# EAGLE design PCB_Cajero_08 (EAGLE 8.6.3)
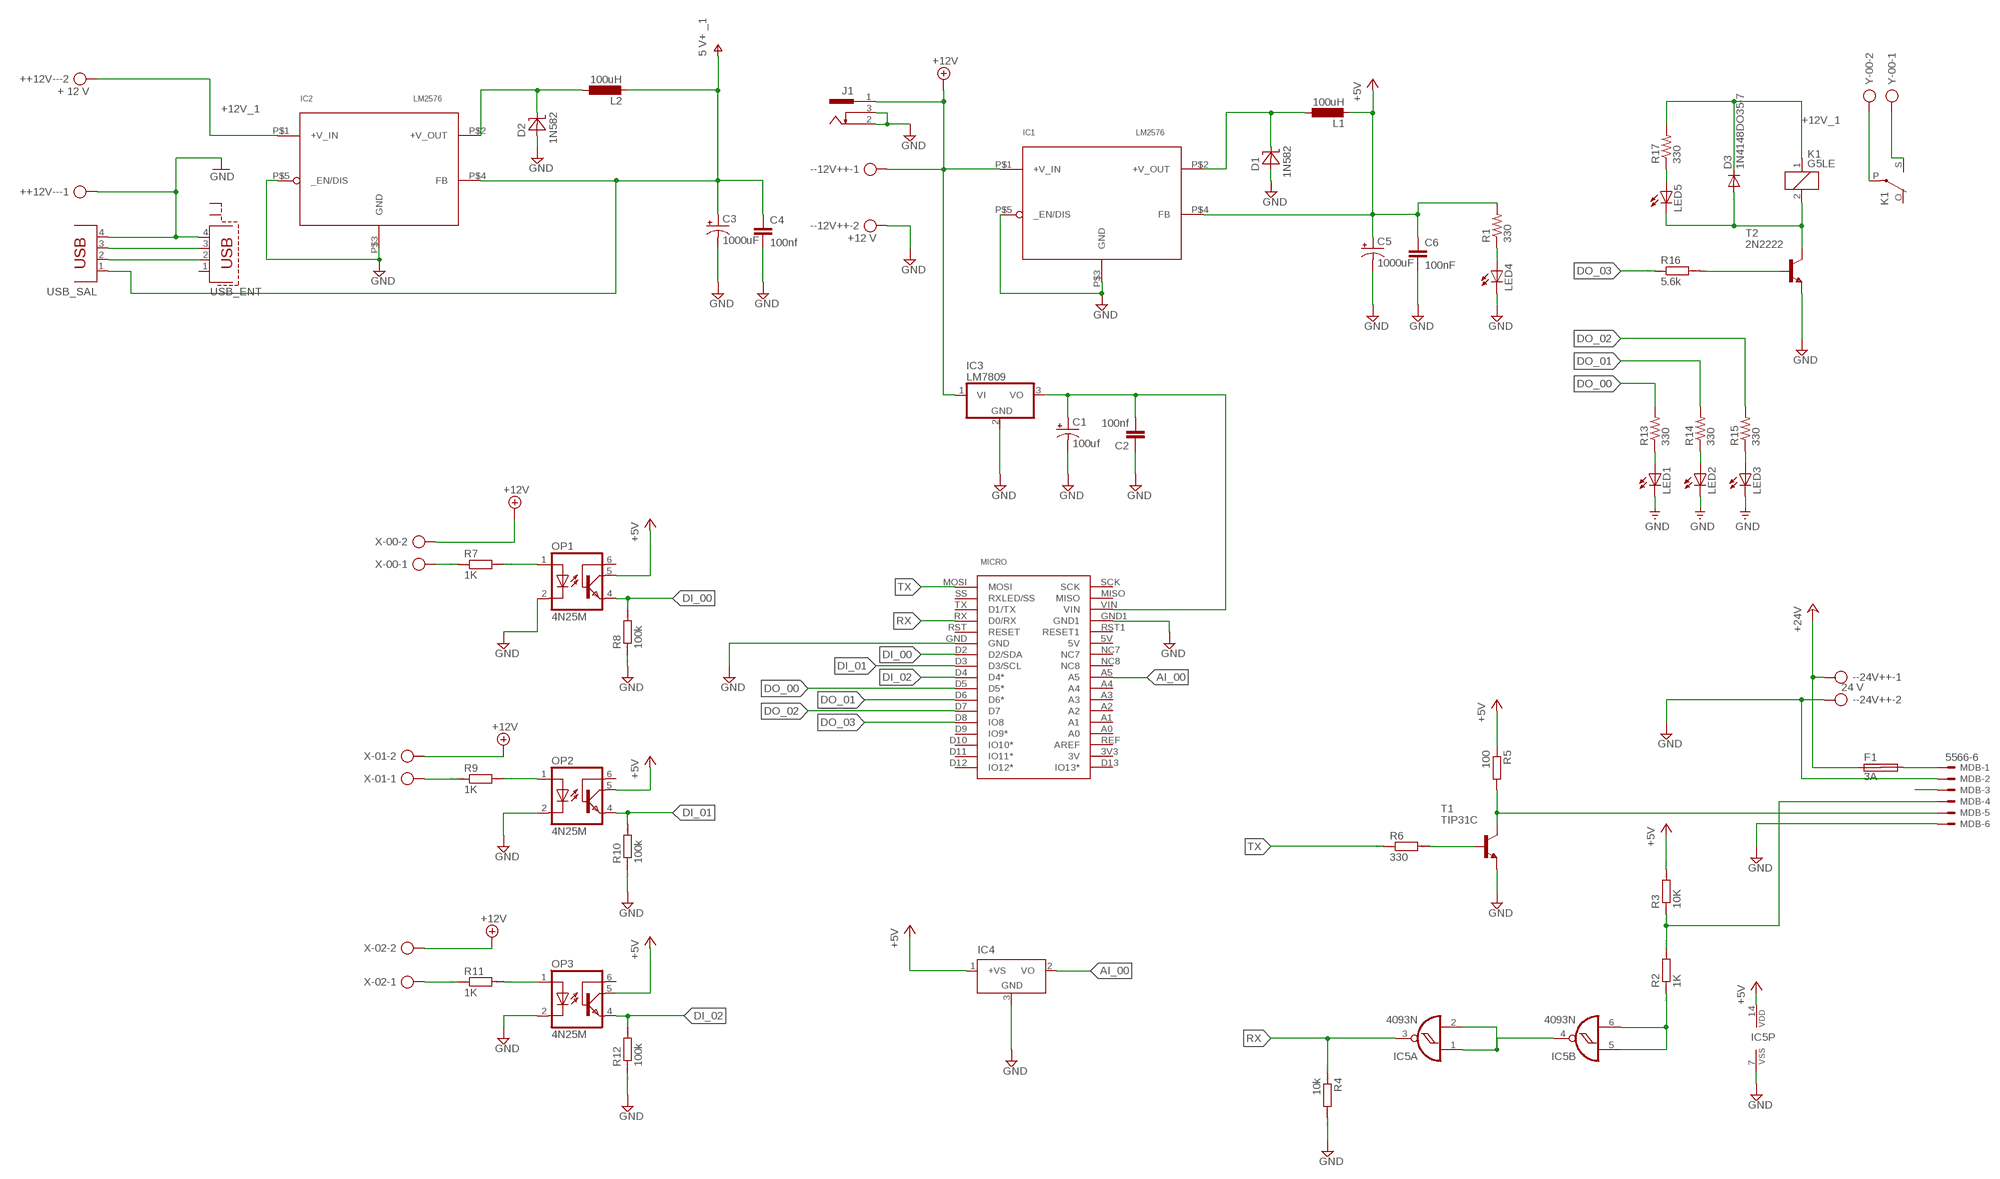
[diagram p0: schematic, sheet 1]

## Parts
++12V--  + 12 V  AK500/2  [AK500/2]
--12V++  +12 V  AK500/2  [AK500/2]
--24V++  24 V  AK500/2  [AK500/2]
C1  100uf  CPOL-USE2.5-6  [E2,5-6]
C2  100nf  C2,5-3  [C2.5-3]
C3  1000uF  CPOL-USE5-5  [E5-5]
C4  100nf  C2,5-3  [C2.5-3]
C5  1000uF  CPOL-USE5-5  [E5-5]
C6  100nF  C2,5-3  [C2.5-3]
D1  1N582  [1N582*]
D2  1N582  [1N582*]
D3  1N4148DO35-7  [DO35-7]
F1  3A  SHK20L  [SHK20L]
IC1  LM2576  LM2576-T05E  [TO220_SEP]
IC2  LM2576  LM2576-T05E  [TO220_SEP]
IC3  LM7809  [TO-220V]
IC4  LM35CZ  [TO92]
IC5  4093N  [DIL14]
J1  KLDVX-0202-A  [KLDVX-0202-A]
K1  G5LE  [G5LE]
L1  100uH  DO3316P  [DO3316P]
L2  100uH  DO3316P  [DO3316P]
LED1  LED5MM  [LED5MM]
LED2  LED5MM  [LED5MM]
LED3  LED5MM  [LED5MM]
LED4  LED5MM  [LED5MM]
LED5  LED5MM  [LED5MM]
MDB  5566-6  [5566-6]
MICRO  ARDUINO_MICROFOOTPRINT  [ARDUINO-MICRO]
OP1  4N25M  [DIL06]
OP2  4N25M  [DIL06]
OP3  4N25M  [DIL06]
R1  330  R-US_0207/7  [0207/7]
R2  1K  R0204/7  [0204/7]
R3  10K  R0204/7  [0204/7]
R4  10k  R0204/7  [0204/7]
R5  100  R-EU_0309/10  [0309/10]
R6  330  R0204/7  [0204/7]
R7  1K  R0204/7  [0204/7]
R8  100k  R0204/7  [0204/7]
R9  1K  R0204/7  [0204/7]
R10  100k  R0204/7  [0204/7]
R11  1K  R0204/7  [0204/7]
R12  100k  R0204/7  [0204/7]
R13  330  R-US_0207/7  [0207/7]
R14  330  R-US_0207/7  [0207/7]
R15  330  R-US_0207/7  [0207/7]
R16  5.6k  R0204/7  [0204/7]
R17  330  R-US_0207/7  [0207/7]
T1  TIP31C  [TO-220V]
T2  2N2222  [TO18]
USB_ENT  PN61729-S  [PN61729-S]
USB_SAL  PN87520  [PN87520]
X-00  AK500/2  [AK500/2]
X-01  AK500/2  [AK500/2]
X-02  AK500/2  [AK500/2]
Y-00  AK500/2  [AK500/2]

## Nets
+5V: C5.+ C6.1 IC1.P$4(FB) IC4.1(+VS) IC5.14(P:VDD) L1.1 OP1.5(COL) OP2.5(COL) OP3.5(COL) R1.2 R3.2 R5.1
+12V: --12V++.1 IC1.P$1(+V_IN) IC3.1(VI) J1.1 X-00.2 X-01.2 X-02.2
+12V_1: ++12V--.2 D3.C IC2.P$1(+V_IN) K1.1 R17.2
+24V: --24V++.1 F1.1A
AI_00: IC4.2(VO) MICRO.A5
DI_00: MICRO.D2(D2/SDA) OP1.4(EMI) R8.2
DI_01: MICRO.D3(D3/SCL) OP2.4(EMI) R10.2
DI_02: MICRO.D4(D4*) OP3.4(EMI) R12.2
DO_00: MICRO.D5(D5*) R13.2
DO_01: MICRO.D6(D6*) R14.2
DO_02: MICRO.D7 R15.2
DO_03: MICRO.D8(IO8) R16.1
GND: ++12V--.1 --12V++.2 --24V++.2 C1.- C2.1 C3.- C4.2 C5.- C6.2 D1.A D2.A IC1.P$3(GND) IC1.P$5(_EN/DIS) IC2.P$3(GND) IC2.P$5(_EN/DIS) IC3.2(GND) IC4.3(GND) IC5.7(P:VSS) J1.2 J1.3 LED1.K(C) LED2.K(C) LED3.K(C) LED4.K(C) MDB.2 MDB.6 MICRO.GND MICRO.GND1 OP1.2(C) OP2.2(C) OP3.2(C) R4.2 R8.1 R10.1 R12.1 T1.3(E) T2.1(E) USB_ENT.4 USB_SAL.4
N$1: C1.+ C2.2 IC3.3(VO) MICRO.VIN
N$2: R7.1 X-00.1
N$3: R11.1 X-02.1
N$4: USB_ENT.3 USB_SAL.3
N$5: USB_ENT.2 USB_SAL.2
N$6: F1.2A MDB.1
N$7: MDB.3
N$8: LED4.A R1.1
N$9: D1.C IC1.P$2(+V_OUT) L1.2
N$10: LED5.A R17.1
N$11: OP1.1(A) R7.2
N$13: LED1.A R13.1
N$14: LED2.A R14.1
N$15: LED3.A R15.1
N$18: OP2.1(A) R9.2
N$19: R9.1 X-01.1
N$22: OP3.1(A) R11.2
N$23: R16.2 T2.2(B)
N$25: IC5.1(A:I0) IC5.2(A:I1) IC5.4(B:O)
N$27: D3.A K1.2 LED5.K(C) T2.3(C)
N$28: K1.P(2:P) Y-00.2
N$29: K1.S(2:S) Y-00.1
N$34: MDB.5 R5.2 T1.2(C)
N$35: R6.2 T1.1(B)
N$36: IC5.5(B:I0) IC5.6(B:I1) R2.1
N$37: MDB.4 R2.2 R3.1
N$39: D2.C IC2.P$2(+V_OUT) L2.2
RX: IC5.3(A:O) MICRO.RX(D0/RX) R4.1
TX: MICRO.MOSI R6.1
V+: C3.+ C4.1 IC2.P$4(FB) L2.1 USB_SAL.1 ; supply symbol labelled 5 V+ _1
Unconnected: F1.1B F1.2B IC5.8(C:I0) IC5.9(C:I1) IC5.10(C:O) IC5.11(D:O) IC5.12(D:I0) IC5.13(D:I1) J1.1@1 J1.2@1 J1.3@1 K1.O(2:O) MICRO.3V3(3V) MICRO.5V MICRO.A0 MICRO.A1 MICRO.A2 MICRO.A3 MICRO.A4 MICRO.D9(IO9*) MICRO.D10(IO10*) MICRO.D11(IO11*) MICRO.D12(IO12*) MICRO.D13(IO13*) MICRO.MISO MICRO.NC7 MICRO.NC8 MICRO.REF(AREF) MICRO.RST1(RESET1) MICRO.RST(RESET) MICRO.SCK MICRO.SS(RXLED/SS) MICRO.TX(D1/TX) OP1.6(BAS) OP2.6(BAS) OP3.6(BAS) USB_ENT.1 USB_ENT.S1 USB_ENT.S2

## Library data of the parts
++12V-- --12V++ --24V++ X-00 X-01 X-02 Y-00 = con-ptr500:AK500/2: CONNECTOR; OC_FARNELL: unknown; OC_NEWARK: unknown
C1 = adafruit:CPOL-US: POLARIZED CAPACITOR, American symbol
C2 C4 C6 = capacitor-wima:C: CAPACITOR naming: grid - package width
C3 C5 = rcl:CPOL-US: POLARIZED CAPACITOR, American symbol; SPICEPREFIX: C
D1 D2 = MOD:1N582*
D3 = diode:1N4148: DIODE high speed (Philips)
F1 = fuse:SHK20L: FUSE HOLDER 5 x 20 mm, SH contact, SHH1 Schukat, E1073 Buerklin; OC_FARNELL: unknown; OC_NEWARK: unknown
IC1 IC2 = LM2576_MOD:LM2576-T05E
IC3 = MOD:LM7809
IC4 = lm35:LM35: Single-Supply Centigrade Temperature Sensor Vout = (10mV/°C x Temp °C) +5mmmV Source: http://www.national.com/ds/LM/LM35.pdf
IC5 = 40xx:4093: Quad 2-input NAND schmitt trigger; SPICEPREFIX: J
J1 = con-kycon:KLDVX-0202-: Power Jack, Vertical, PCB Mount, 2.0 mm, 2.5 mm, 3.0 mm Center Pin Source: KLDVX-0202x.pdf; OC_FARNELL: unknown; OC_NEWARK: unknown
K1 = relay:G5LE: RELAY 1 x switch, 10 A/120 V AC, 8 A/30 V DC, Omron; OC_FARNELL: unknown; OC_NEWARK: unknown
L1 L2 = MOD:DO3316P: COILCRAFT; OC_FARNELL: unknown; OC_NEWARK: unknown
LED1-LED5 = adafruit:LED: LED OSRAM: - CHIPLED LG R971, LG N971, LY N971, LG Q971, LY Q971, LO R971, LY R971 LH N974, LH R974 LS Q976, LO Q976, LY Q976 LO Q996 - Hyper CHIPLED LW Q18S LB Q993, LB Q99A, LB R99A - SideLED LS A670, LO A670, LY A670, LG A670, LP A670 LB A673, LV A673, LT A673, LW A673 LH A674 LY A675 LS A676, LA A676, LO A676, LY A676, LW A676 LS A679, LY A679, LG A679 - Hyper Micro SIDELED® LS Y876, LA Y876, LO Y876, LY Y876 LT Y87S - SmartLED LW L88C, LW L88S LB L89C, LB L89S, LG L890 LS L89K, LO L89K, LY L89K LS L896, LA L896, LO L896, LY L896 - TOPLED LS T670, LO T670, LY T670, LG T670, LP T670 LSG T670, LSP T670, LSY T670, LOP T670, LYG T670 LG T671, LOG T671, LSG T671 LB T673, LV T673, LT T673, LW T673 LH T674 LS T676, LA T676, LO T676, LY T676, LB T676, LH T676, LSB T676, LW T676 LB T67C, LV T67C, LT T67C, LS T67K, LO T67K, LY T67K, LW E67C LS E67B, LA E67B, LO E67B, LY E67B, LB E67C, LV E67C, LT E67C LW T67C LS T679, LY T679, LG T679 LS T770, LO T770, LY T770, LG T770, LP T770 LB T773, LV T773, LT T773, LW T773 LH T774 LS E675, LA E675, LY E675, LS T675 LS T776, LA T776, LO T776, LY T776, LB T776 LHGB T686 LT T68C, LB T68C - Hyper Mini TOPLED® LB M676 - Mini TOPLED Santana® LG M470 LS M47K, LO M47K, LY M47K Source: http://www.osram.convergy.de/
MDB = MOD:5566-6: Mini FIT connector 6 pol Source: http://www.molex.com; MF: MOLEX; MPN: 95566-61002; OC_FARNELL: unknown; OC_NEWARK: 22K8620
MICRO = arduino-micro:ARDUINO_MICRO
OP1-OP3 = optocoupler:4N*?M: General Purpose 6-Pin Phototransistor Optocouplers Source: http://www.fairchildsemi.com/ds/4N/4N35-M.pdf; MPN: 4N25-M; OC_FARNELL: 1021349; OC_NEWARK: 98K9084
R1 R13-R15 R17 = rcl:R-US_: RESISTOR, American symbol; SPICEPREFIX: R
R2-R4 R6-R12 R16 = eagle-ltspice:R: RESISTOR, European symbol; SPICEMODEL: NONE; SPICEPREFIX: R
R5 = rcl:R-EU_: RESISTOR, European symbol; SPICEPREFIX: R
T1 = MOD:TIP31C
T2 = transistor-neu-to92:2N2222: NPN TRANSISTOR
USB_ENT = con-berg:PN61729-S: BERG USB connector; OC_FARNELL: unknown; OC_NEWARK: unknown
USB_SAL = con-berg:PN87520: BERG USB connector; OC_FARNELL: unknown; OC_NEWARK: unknown

## Board
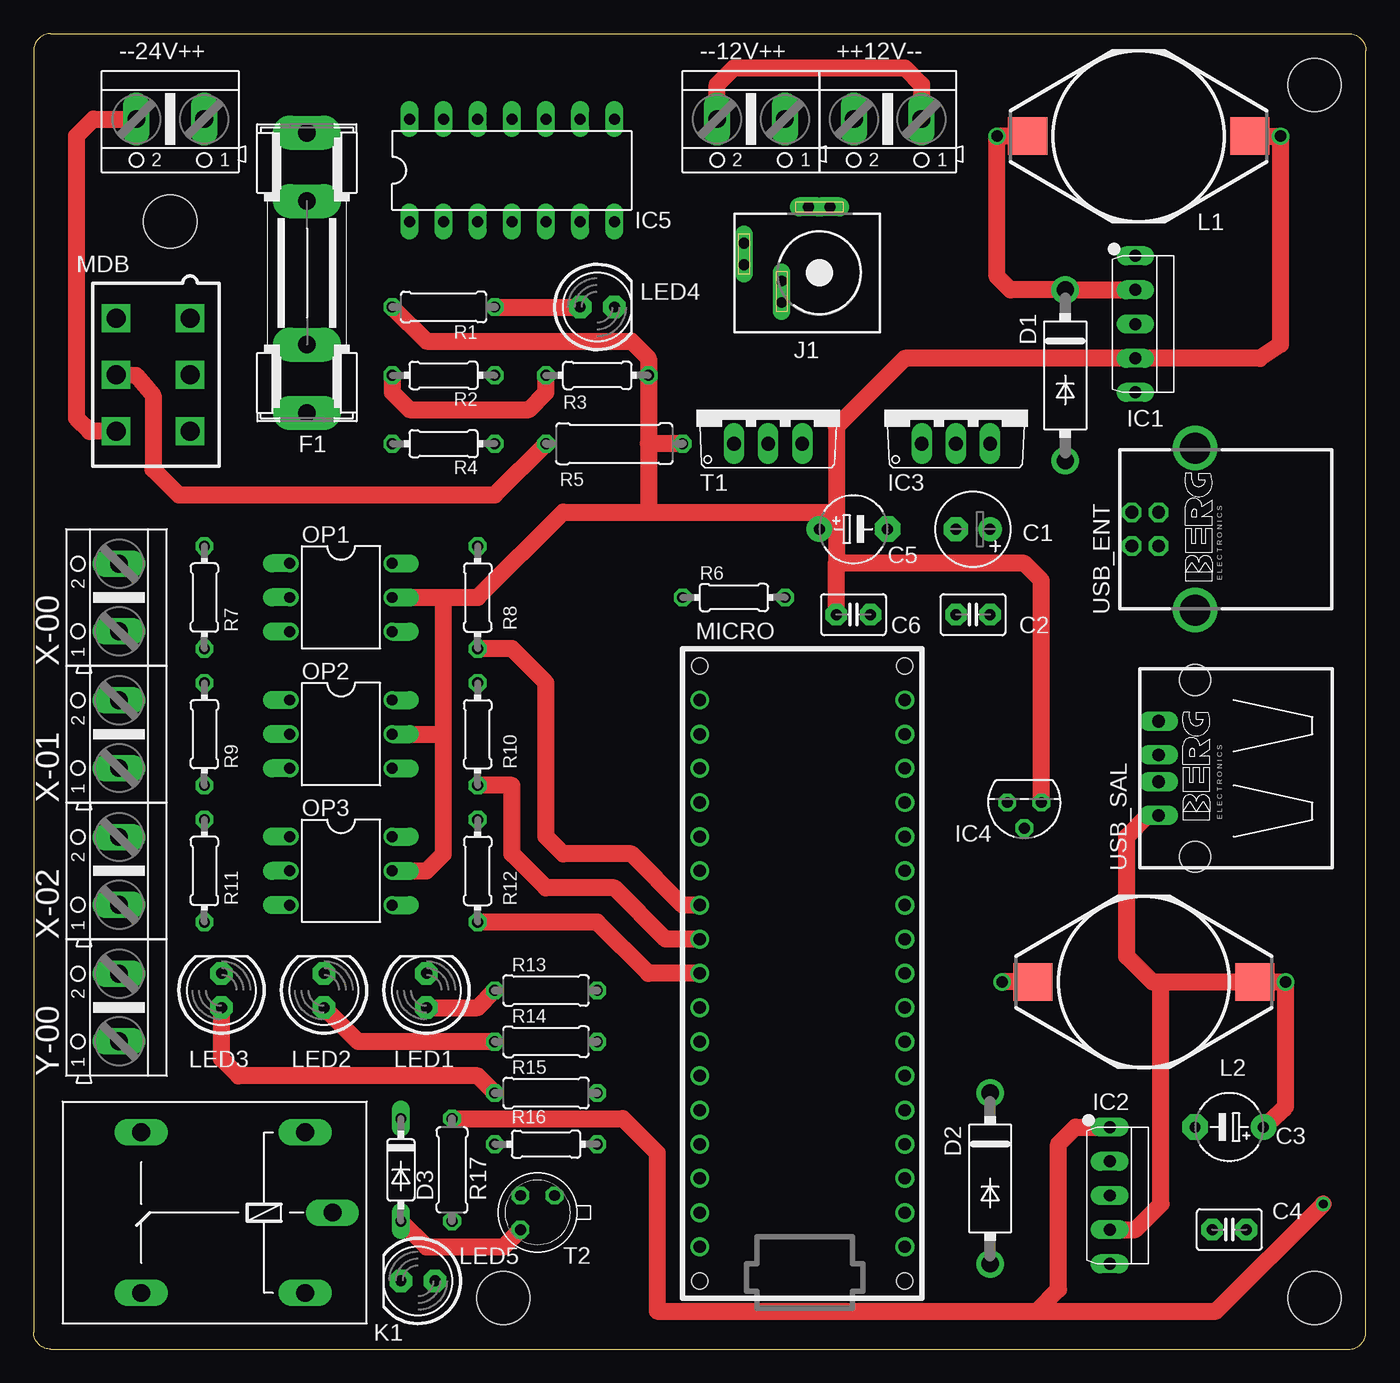
[diagram p1: board, top side]
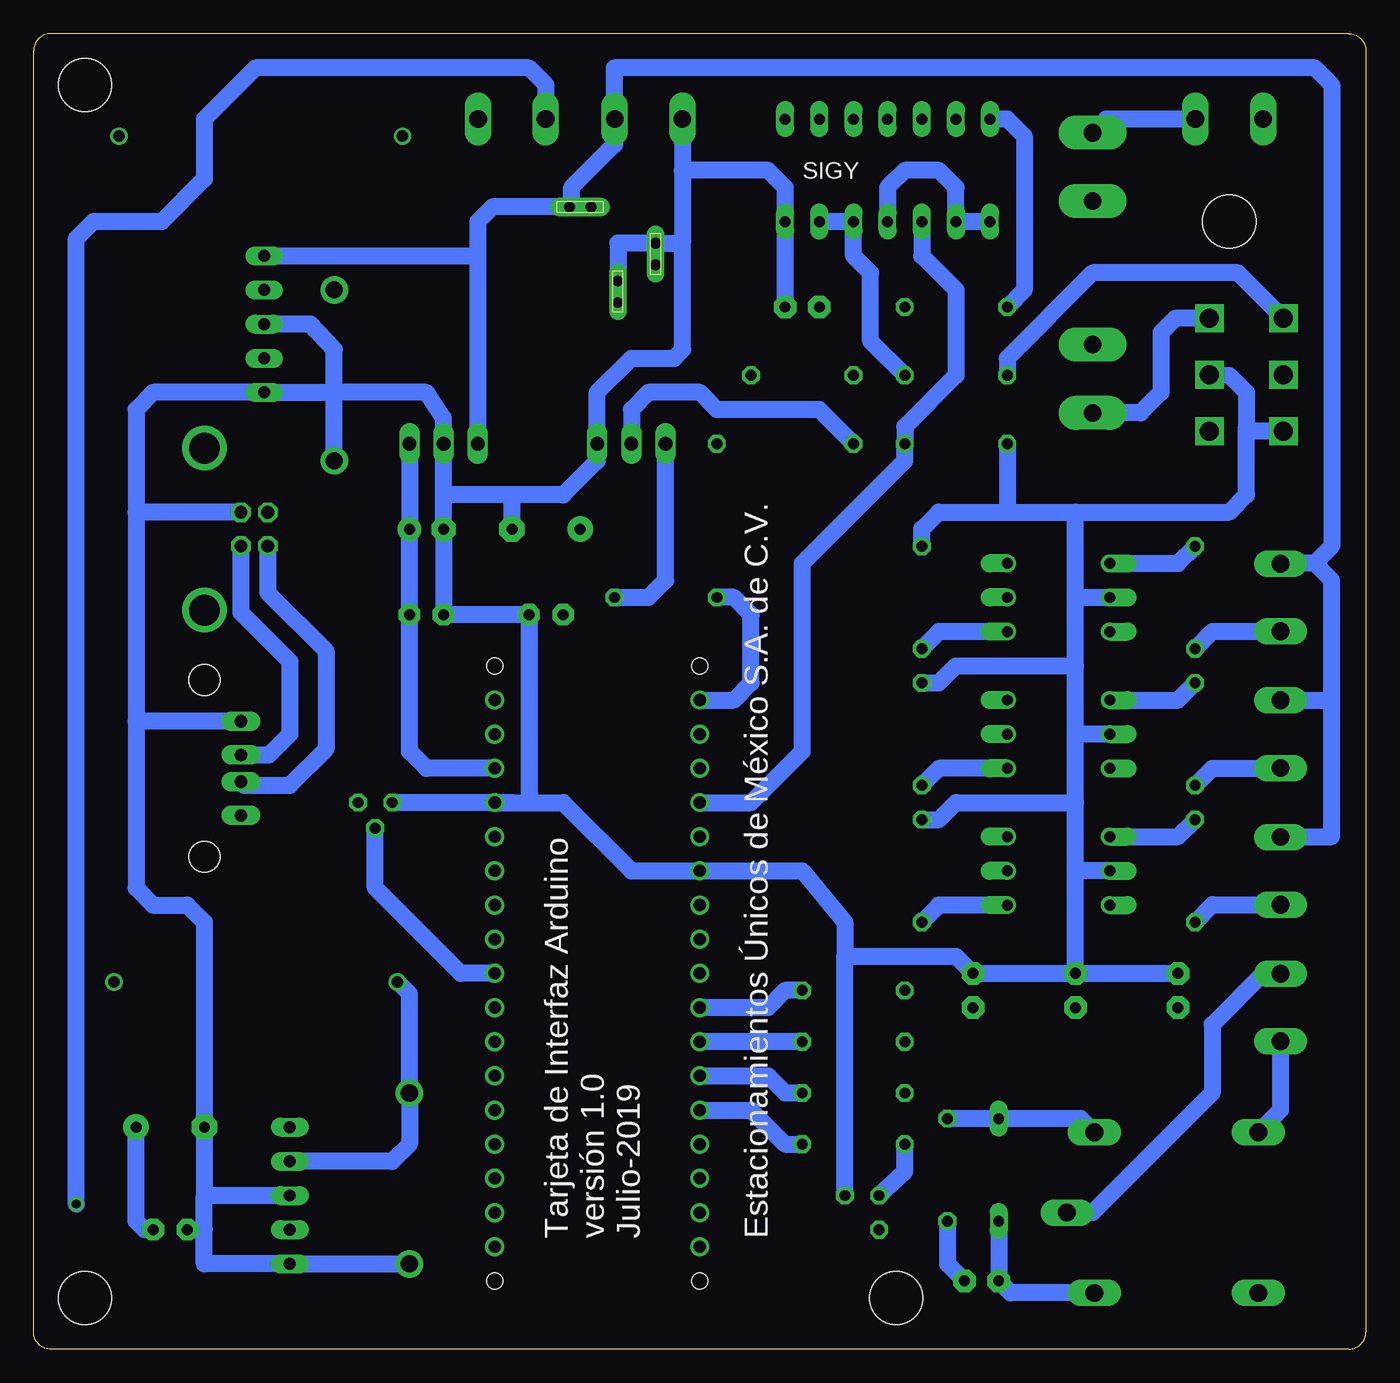
[diagram p2: board, bottom side, seen from below]

Size 99.06 x 97.79 mm. Coordinates in mm from the lower left corner, seen from the top.
Outline: 1.27,97.79 1.27,97.78
Outline: 1.27,97.79 arc90 0,96.52 0,1.27 arc90 1.27,0 97.79,0 arc90 99.06,1.27 99.06,96.52 arc90 97.79,97.79 1.27,97.79
Copper layers (1*16): Top 0.035mm / dielectric 1.5mm / Bottom 0.035mm
Design rules "default": minimum track width 6mil, minimum drill 0.35mm, track to track 6mil, track to pad 6mil, pad to pad 6mil, via to via 6mil, smd to smd 6mil, copper to edge 40mil, drill to drill 6mil, minimum pad ring 10mil, minimum via ring 8mil, stop-mask expansion 4mil, vias tented up to drill 0mil, thermal gap 10mil
Holes 3.97 mm at 10.16,83.82 95.25,93.98 95.25,3.81 34.92,3.81

### Footprints (pad centres in the part's own frame; a part is rotated, then mirrored left to right if it is on the bottom)
AK500/2 = drill 1.321 long: 1 -2.515,0; 2 2.515,0
E2,5-6 = drill 0.813 pad 1.778: + -1.27,0 | drill 0.813 pad 1.778 octagon: - 1.27,0
C2.5-3 = drill 0.813 pad 1.6 octagon: 1 -1.27,0; 2 1.27,0
E5-5 = drill 0.813 pad 1.905: + -2.54,0 | drill 0.813 pad 1.905 octagon: - 2.54,0
1N582* = drill 1.27 pad 2.032: A 5.715,0; C -6.985,0
DO35-7 = drill 0.813 long: A 3.81,0; C -3.81,0
SHK20L = drill 1.321 pad 2.54 long: 1A -10.414,0; 1B -5.334,0; 2A 10.414,0; 2B 5.334,0
TO220_SEP = drill 0.889 pad 1.219 long: P$1 -5.08,0; P$2 -2.54,0; P$3 0,0; P$4 2.54,0; P$5 5.08,0
TO-220V = drill 1.016 long: 1 -2.54,0; 2 0,0; 3 2.54,0
TO92 = drill 0.813 octagon: 1 -1.27,0; 2 0,1.905; 3 1.27,0
DIL14 = drill 0.813 long: 1 -7.62,-3.81; 2 -5.08,-3.81; 3 -2.54,-3.81; 4 0,-3.81; 5 2.54,-3.81; 6 5.08,-3.81; 7 7.62,-3.81; 8 7.62,3.81; 9 5.08,3.81; 10 2.54,3.81; 11 0,3.81; 12 -2.54,3.81; 13 -5.08,3.81; 14 -7.62,3.81
KLDVX-0202-A = drill 0.8 pad 1.4 long: 1 -4.9,0.8; 1@1 -4.9,-0.8 | drill 0.8 pad 1.3 long: 2 -2.2,-5.6; 2@1 -0.6,-5.6; 3 0.6,-2.8; 3@1 2.2,-2.8
G5LE = drill 1.321 long: 1 -7.493,-5.969; 2 -7.493,5.969; O 4.699,5.969; P -9.525,0; S 4.699,-5.969
DO3316P = smd 2.92 x 2.79: 1 -8.255,0; 2 8.255,0
LED5MM = drill 0.813 pad 1.676 octagon: A -1.27,0; K 1.27,0
5566-6 = drill 1.4 square: 1 4.2,-2.75; 2 0,-2.75; 3 -4.2,-2.75; 4 4.2,2.75; 5 0,2.75; 6 -4.2,2.75
ARDUINO-MICRO = drill 0.9: 3V3 16.51,3.81; 5V 16.51,29.21; A0 16.51,8.89; A1 16.51,11.43; A2 16.51,13.97; A3 16.51,16.51; A4 16.51,19.05; A5 16.51,21.59; D2 1.27,26.67; D3 1.27,24.13; D4 1.27,21.59; D5 1.27,19.05; D6 1.27,16.51; D7 1.27,13.97; D8 1.27,11.43; D9 1.27,8.89; D10 1.27,6.35; D11 1.27,3.81; D12 1.27,1.27; D13 16.51,1.27; GND 1.27,29.21; GND1 16.51,34.29; MISO 16.51,39.37; MOSI 1.27,41.91; NC7 16.51,26.67; NC8 16.51,24.13; REF 16.51,6.35; RST 1.27,31.75; RST1 16.51,31.75; RX 1.27,34.29; SCK 16.51,41.91; SS 1.27,39.37; TX 1.27,36.83; VIN 16.51,36.83 | hole 1.2: 1.27,-1.27; 16.51,-1.27; 1.27,44.45; 16.51,44.45
DIL06 = drill 0.813 offset: 1 -2.54,-3.81; 2 0,-3.81; 3 2.54,-3.81; 4 2.54,3.81; 5 0,3.81; 6 -2.54,3.81
0207/7 = drill 0.813 octagon: 1 -3.81,0; 2 3.81,0
0204/7 = drill 0.813 octagon: 1 -3.81,0; 2 3.81,0
0309/10 = drill 0.813 octagon: 1 -5.08,0; 2 5.08,0
TO18 = drill 0.813 octagon: 1 -1.27,-1.27; 2 1.27,-1.27; 3 1.27,1.27
PN61729-S = drill 0.95 octagon: 1 1.25,4.71; 2 -1.25,4.71; 3 -1.25,2.71; 4 1.25,2.71 | drill 2.3 pad 2.9: S1 -6.02,0; S2 6.02,0
PN87520 = drill 0.95 long: 1 -3.5,2.71; 2 -1,2.71; 3 1,2.71; 4 3.5,2.71 | hole 2.3: -6.57,0; 6.57,0

### Placement (x,y rotation side)
++12V--  63.5,91.44 180 top
--12V++  53.34,91.44 180 top
--24V++  10.16,91.44 180 top
C1  69.85,60.96 180 top
C2  69.85,54.61 0 top
C3  88.9,16.51 180 top
C4  88.9,8.89 180 top
C5  60.96,60.96 0 top
C6  60.96,54.61 0 top
D1  76.71,71.75 270 top
D2  71.12,12.06 270 top
D3  27.3,13.34 270 top
F1  20.32,80.01 270 top
IC1  81.92,76.2 270 top
IC2  80.01,11.43 270 top
IC3  68.58,67.31 0 top
IC4  73.66,40.64 180 top
IC5  35.56,87.63 0 top
J1  58.42,80.01 270 top
K1  12.7,10.16 180 top
L1  82.17,90.17 180 top
L2  82.55,27.3 180 top
LED1  29.21,26.67 90 top
LED2  21.59,26.67 90 top
LED3  13.97,26.67 90 top
LED4  41.91,77.47 0 top
LED5  28.57,5.08 180 top
MDB  8.88,72.43 90 top
MICRO  48.26,6.35 0 top
OP1  22.86,55.88 270 top
OP2  22.86,45.72 270 top
OP3  22.86,35.56 270 top
R1  30.48,77.47 180 top
R2  30.48,72.39 180 top
R3  41.91,72.39 0 top
R4  30.48,67.31 180 top
R5  43.18,67.31 180 top
R6  52.07,55.88 0 top
R7  12.7,55.88 90 top
R8  33.02,55.88 270 top
R9  12.7,45.72 90 top
R10  33.02,45.72 270 top
R11  12.7,35.56 90 top
R12  33.02,35.56 270 top
R13  38.1,26.67 0 top
R14  38.1,22.86 0 top
R15  38.1,19.05 0 top
R16  38.1,15.24 180 top
R17  31.11,13.34 90 top
T1  54.61,67.31 0 top
T2  37.47,10.16 180 top
USB_ENT  86.36,60.96 90 top
USB_SAL  86.36,43.18 90 top
X-00  6.35,55.88 90 top
X-01  6.35,45.72 90 top
X-02  6.35,35.56 90 top
Y-00  6.35,25.4 90 top

### Tracks (layer width: path | path; a pad name or v marks a point on that pad's centre or on a via)
+5V  (via drill 0.85)
  Top 1.27: 59.69,62.23 59.69,68.58 64.77,73.66 IC1.P$4 91.19,73.66 92.71,74.68 v92.71,90.17 L1.1 | OP3.5 29.21,35.56 30.48,36.83 30.48,45.72 | 30.48,45.72 30.48,55.88 | OP2.5 30.48,45.72 | OP1.5 30.48,55.88 | 30.48,55.88 33.02,55.88 39.37,62.23 45.72,62.23 | IC4.1 74.93,57.15 73.66,58.42 59.69,58.42 | 45.72,62.23 59.69,62.23 | R1.2 29.21,74.93 44.45,74.93 45.72,73.66 R3.2 45.72,67.31 | 45.72,67.31 45.72,62.23 | R5.1 45.72,67.31 | C6.1 59.69,58.42 | 59.69,62.23 59.69,60.96 | 59.69,60.96 59.69,58.42 | C5.+ 59.69,60.96
  Bottom 1.27: IC5.14 26.67,91.44 25.4,90.17 25.4,78.74 R1.2
+12V
  Top 1.27: X-00.2 6.33,58.42
  Bottom 1.27: X-02.2 6.33,38.1 2.54,38.1 2.54,48.26 | 2.54,48.26 2.54,57.15 3.81,58.42 | 3.81,58.42 6.35,58.42 X-00.2 | X-01.2 6.33,48.26 2.54,48.26 | 3.81,58.42 2.54,59.69 2.54,93.98 3.81,95.25 55.88,95.25 55.88,91.47 --12V++.1 55.85,89.56 59.05,86.36 59.05,85.08 J1.1 64.95,84.91 66.04,83.82 66.04,81.28 | 66.04,81.28 IC3.1 | IC1.P$1 66.04,81.28
+12V_1  (via drill 0.65)
  Top 1.27: 74.58,2.83 76.2,4.45 76.2,15.24 77.47,16.51 IC2.P$1 | 74.58,2.83 46.35,2.83 46.35,14.61 43.81,17.14 R17.2 | 74.58,2.83 87.92,2.83 v95.89,10.79
  Bottom 1.27: ++12V--.2 60.96,91.47 60.96,93.98 62.23,95.25 82.55,95.25 86.36,91.44 86.36,87 89.53,83.82 94.61,83.82 95.89,82.55 v95.89,10.79 | K1.1 21.21,17.14 D3.C R17.2
+24V
  Bottom 1.27: F1.1A 19.3,91.44 --24V++.1
AI_00
  Bottom 1.27: MICRO.A5 67.31,27.94 73.66,34.29 IC4.2
DI_00
  Top 1.27: MICRO.D2 48.26,33.02 44.45,36.83 39.37,36.83 38.1,38.1 38.1,49.53 35.56,52.07 R8.2
  Bottom 1.27: OP1.4 31.75,53.34 R8.2
DI_01
  Top 1.27: MICRO.D3 46.99,30.48 43.18,34.29 38.1,34.29 35.56,36.83 35.56,41.91 R10.2
  Bottom 1.27: OP2.4 31.75,43.18 R10.2
DI_02
  Top 1.27: MICRO.D4 45.72,27.94 41.91,31.75 R12.2
  Bottom 1.27: OP3.4 31.75,33.02 R12.2
DO_00
  Bottom 1.27: R13.2 43.18,26.67 44.45,25.4 MICRO.D5
DO_01
  Bottom 1.27: R14.2 MICRO.D6
DO_02
  Bottom 1.27: MICRO.D7 44.45,20.32 43.18,19.05 R15.2
DO_03
  Bottom 1.27: MICRO.D8 45.72,17.78 43.18,15.24 R16.1
GND
  Top 1.27: --12V++.2 50.83,94 52.07,95.25 64.77,95.25 66.02,94 ++12V--.1 | MDB.6 4.16,68.23 3.17,69.22 3.17,90.17 4.45,91.44 --24V++.2
  Bottom 1.27: 63.5,63.5 59.69,63.5 57.15,66.04 T1.3 57.15,71.12 54.61,73.66 51.44,73.66 50.8,74.3 50.83,74.32 50.83,82.21 | 63.5,63.5 68.58,63.5 | 68.58,63.5 IC3.2 68.58,69.22 69.85,71.12 76.71,71.12 | 68.58,63.5 C1.- C2.1 C6.2 62.23,40.64 | 50.83,87.63 50.83,82.21 | 63.5,40.64 MICRO.GND1 | D1.A 76.71,71.12 | 76.71,71.12 76.71,74.3 78.49,76.2 IC1.P$3 | MICRO.GND1 62.23,40.64 | 62.23,40.64 59.69,40.64 54.61,35.56 MICRO.GND 41.91,35.56 38.73,31.75 38.73,29.21 | T2.1 38.73,29.21 | 38.73,29.21 30.48,29.21 LED1.K LED2.K | LED2.K LED3.K | LED2.K 21.59,35.56 | 21.59,35.56 21.59,40.64 | 21.59,40.64 21.59,45.72 | 21.59,45.72 21.59,50.8 | 21.59,50.8 21.59,55.88 | 21.59,55.88 OP1.2 | OP2.2 21.59,45.72 | OP3.2 21.59,35.56 | R8.1 33.02,60.96 31.75,62.23 26.67,62.23 | R10.1 31.75,49.53 30.48,50.8 21.59,50.8 | R12.1 31.75,39.37 30.48,40.64 21.59,40.64 | MDB.2 10.16,72.39 8.89,71.12 8.89,68.58 | 8.54,68.23 8.5,68.19 | R4.2 26.67,62.23 | MICRO.GND1 IC4.3 | 91.44,62.21 91.44,69.85 90.17,71.12 IC1.P$5 76.71,71.12 | 91.44,62.21 91.44,46.68 | 91.44,46.68 91.44,34.29 90.17,33.02 87.63,33.02 86.36,31.75 C3.- 86.36,11.43 | 50.83,87.63 44.45,87.63 43.18,86.36 IC5.7 LED4.K | D2.A IC2.P$5 86.36,6.35 86.36,8.89 | J1.3 55.62,82.21 J1.2 50.83,82.21 | --12V++.2 50.83,87.63 | USB_SAL.4 91.44,46.68 | USB_ENT.4 91.44,62.21 | IC2.P$3 86.36,11.43 | 86.36,8.89 86.36,11.43 | C4.2 86.36,8.89 | C5.- 63.5,63.5 | 26.67,62.23 21.59,62.23 | 21.59,62.23 10.16,62.23 8.89,63.5 8.89,68.58 | 21.59,55.88 21.59,62.23 | MDB.6 8.54,68.23 | 8.54,68.23 8.89,68.58
N$1
  Bottom 1.27: IC3.3 C1.+ C2.2 71.12,44.45 69.85,43.18 MICRO.VIN
N$2
  Bottom 1.27: R7.1 11.4,53.37 X-00.1
N$3
  Bottom 1.27: X-02.1 11.4,33.05 R11.1
N$4
  Bottom 1.27: USB_SAL.3 81.55,44.18 80.01,45.72 80.01,51.14 83.65,54.78 USB_ENT.3
N$5
  Bottom 1.27: USB_SAL.2 83.38,41.91 80.01,41.91 77.32,44.6 77.32,51.92 81.65,56.25 USB_ENT.2
N$6
  Bottom 1.27: F1.2A 16.76,69.6 15.24,71.12 15.24,75.56 14.17,76.63 MDB.1
N$8
  Top 1.27: R1.1 LED4.A
N$9  (via drill 0.85)
  Top 1.27: L1.2 v71.63,90.17 71.63,79.76 72.64,78.74 D1.C IC1.P$2
N$10
  Bottom 1.27: R17.1 31.11,6.35 LED5.A
N$11
  Bottom 1.27: OP1.1 13.97,58.42 R7.2
N$13
  Top 1.27: LED1.A 33.02,25.4 R13.1
N$14
  Top 1.27: R14.1 24.13,22.86 LED2.A
N$15
  Top 1.27: LED3.A 13.97,21.59 15.24,20.32 33.02,20.32 R15.1
N$18
  Bottom 1.27: OP2.1 13.97,48.26 R9.2
N$19
  Bottom 1.27: R9.1 11.43,43.18 6.38,43.18 X-01.1
N$22
  Bottom 1.27: OP3.1 13.97,38.1 R11.2
N$23
  Bottom 1.27: T2.2 34.29,13.21 R16.2
N$25
  Bottom 1.27: IC5.1 IC5.2 30.48,86.36 31.75,87.63 34.29,87.63 35.56,86.36 IC5.4
N$27
  Top 1.27: D3.A 29.21,7.62 34.92,7.62 T2.3
  Bottom 1.27: K1.2 26.42,4.19 LED5.K D3.A
N$28
  Bottom 1.27: Y-00.2 7.59,27.91 7.62,27.94 11.43,24.13 11.43,19.05 20.32,10.16 K1.P
N$29
  Bottom 1.27: Y-00.1 6.35,17.78 K1.S
N$34
  Top 1.27: MDB.5 7.62,72.39 8.89,70.91 8.89,65.41 10.79,63.5 34.29,63.5 R5.2
  Bottom 1.27: R5.2 40.64,69.85 48.26,69.85 49.53,71.12 53.34,71.12 54.61,69.85 T1.2
N$35
  Bottom 1.27: R6.2 53.34,55.88 52.07,57.15 T1.1
N$36
  Bottom 1.27: IC5.6 IC5.5 38.1,81.28 36.83,80.01 36.83,74.93 R2.1
N$37
  Top 1.27: R2.2 26.67,71.12 27.94,69.85 36.83,69.85 38.1,71.12 R3.1
  Bottom 1.27: R2.2 26.67,73.66 20.32,80.01 9.51,80.01 MDB.4
N$39  (via drill 0.85)
  Top 1.27: L2.2 v72.01,27.3
  Bottom 1.27: IC2.P$2 72.39,13.97 71.12,15.24 D2.C 71.12,26.42 v72.01,27.3
RX
  Bottom 1.27: IC5.3 33.02,81.28 30.48,78.74 30.48,72.39 34.29,68.58 R4.1 34.29,66.04 41.91,58.42 41.91,44.45 45.72,40.64 MICRO.RX
TX
  Bottom 1.27: MICRO.MOSI 46.99,48.26 45.72,49.53 45.72,54.61 46.99,55.88 R6.1
V+  (via drill 0.85)
  Top 1.27: USB_SAL.1 82.86,39.68 81.28,38.1 81.28,29.21 83.19,27.3 83.82,27.3 | 83.82,27.3 L2.1 v93.09,27.3 93.09,18.03 C3.+ | IC2.P$4 81.92,8.89 83.82,10.79 83.82,27.3
  Bottom 1.27: C4.1 90.81,8.89 91.44,9.53 C3.+

### Text on the board
bNames: SIGY | Estacionamientos Únicos de México S.A. de C.V. | Tarjeta de Interfaz Arduino / versión 1.0 / Julio-2019